# Altium schematic sheet led_em_kian_220v_v2_MANAGE.SchDoc
size A
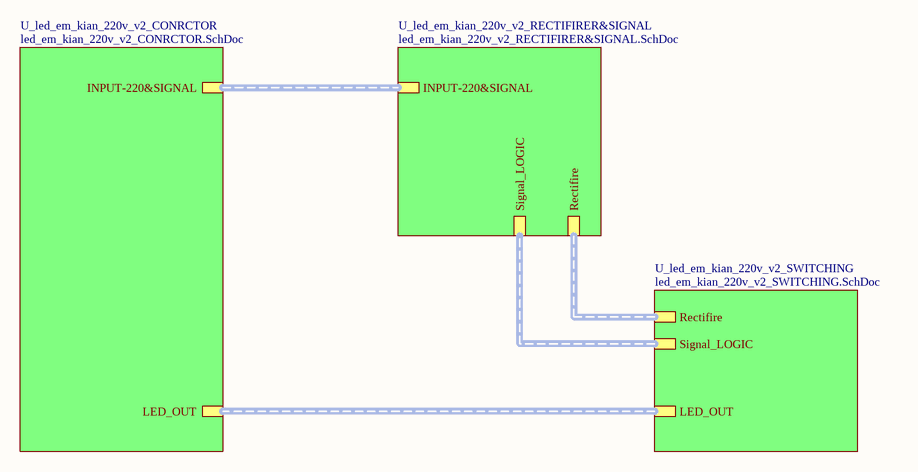
[diagram p0: led_em_kian_220v_v2_MANAGE.SchDoc]

## Sub-sheets
U_led_em_kian_220v_v2_CONRCTOR = led_em_kian_220v_v2_CONRCTOR.SchDoc: INPUT-220&SIGNAL (harness INPUT-220&SIGNAL), LED_OUT
U_led_em_kian_220v_v2_RECTIFIRER&SIGNAL = led_em_kian_220v_v2_RECTIFIRER&SIGNAL.SchDoc: INPUT-220&SIGNAL (harness INPUT-220&SIGNAL), Rectifire (harness Rectifire), Signal_LOGIC (harness Signal_LOGIC)
U_led_em_kian_220v_v2_SWITCHING = led_em_kian_220v_v2_SWITCHING.SchDoc: Signal_LOGIC (harness Signal_LOGIC), Rectifire (harness Rectifire), LED_OUT (harness LED_OUT)

## Buses and harness runs
harness sheet U_led_em_kian_220v_v2_CONRCTOR/INPUT-220&SIGNAL = sheet U_led_em_kian_220v_v2_RECTIFIRER&SIGNAL/INPUT-220&SIGNAL
harness sheet U_led_em_kian_220v_v2_CONRCTOR/LED_OUT = sheet U_led_em_kian_220v_v2_SWITCHING/LED_OUT
harness sheet U_led_em_kian_220v_v2_RECTIFIRER&SIGNAL/Rectifire = sheet U_led_em_kian_220v_v2_SWITCHING/Rectifire
harness sheet U_led_em_kian_220v_v2_RECTIFIRER&SIGNAL/Signal_LOGIC = sheet U_led_em_kian_220v_v2_SWITCHING/Signal_LOGIC